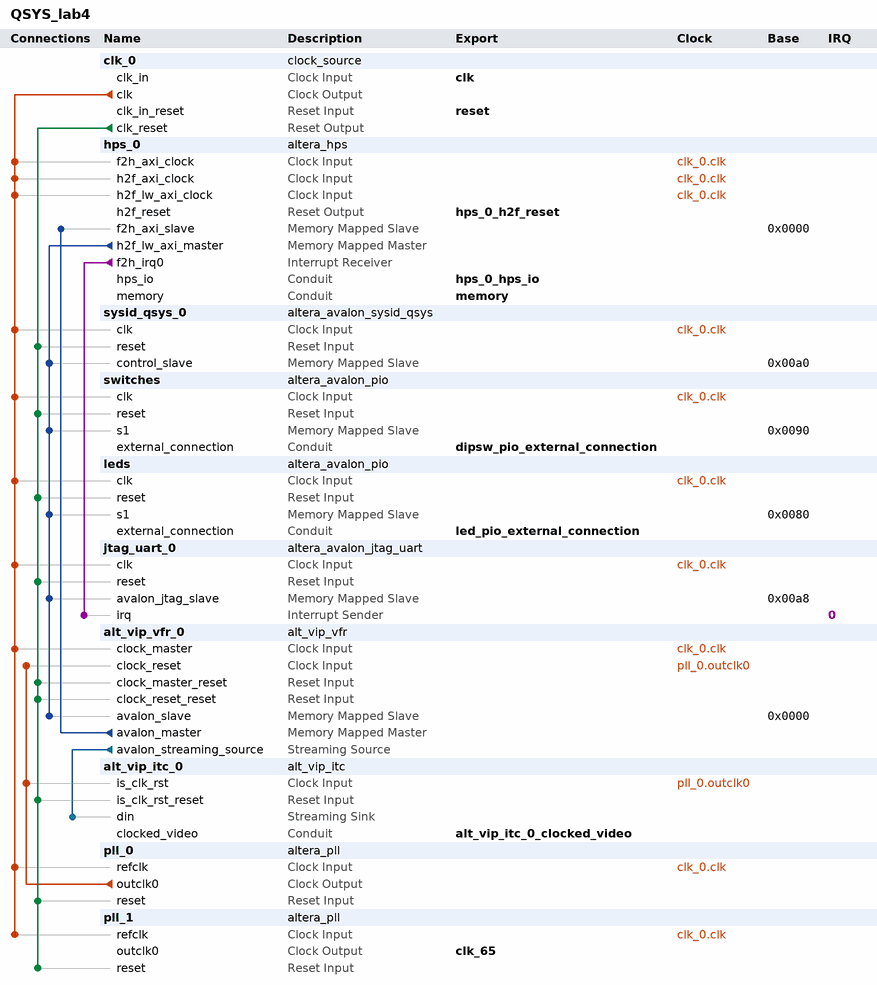
[diagram p0: system contents]
# Platform Designer (Qsys) system QSYS_lab4, Cyclone V 5CSEMA5F31C6
# Parameters at their usual value, and those the tool derives, are not listed.
package require -exact qsys 15.0
create_system QSYS_lab4
set_project_property DEVICE_FAMILY {Cyclone V}
set_project_property DEVICE 5CSEMA5F31C6

add_instance clk_0 clock_source 15.0
set_instance_parameter_value clk_0 clockFrequency 50000000

add_instance hps_0 altera_hps 15.0
set_instance_parameter_value hps_0 BOOTFROMFPGA_Enable true
set_instance_parameter_value hps_0 EMAC1_Mode N/A
set_instance_parameter_value hps_0 EMAC1_PinMuxing Unused
set_instance_parameter_value hps_0 F2SCLK_COLDRST_Enable false
set_instance_parameter_value hps_0 F2SCLK_DBGRST_Enable false
set_instance_parameter_value hps_0 F2SCLK_WARMRST_Enable false
set_instance_parameter_value hps_0 F2SINTERRUPT_Enable true
set_instance_parameter_value hps_0 F2S_Width 3
set_instance_parameter_value hps_0 FPGA_PERIPHERAL_OUTPUT_CLOCK_FREQ_EMAC0_GTX_CLK 100
set_instance_parameter_value hps_0 FPGA_PERIPHERAL_OUTPUT_CLOCK_FREQ_EMAC0_MD_CLK 2.5
set_instance_parameter_value hps_0 FPGA_PERIPHERAL_OUTPUT_CLOCK_FREQ_EMAC1_GTX_CLK 100
set_instance_parameter_value hps_0 FPGA_PERIPHERAL_OUTPUT_CLOCK_FREQ_EMAC1_MD_CLK 2.5
set_instance_parameter_value hps_0 HPS_PROTOCOL DDR3
set_instance_parameter_value hps_0 I2C0_Mode N/A
set_instance_parameter_value hps_0 I2C0_PinMuxing Unused
set_instance_parameter_value hps_0 I2C1_Mode N/A
set_instance_parameter_value hps_0 I2C1_PinMuxing Unused
set_instance_parameter_value hps_0 LWH2F_Enable true
set_instance_parameter_value hps_0 MEM_BANKADDR_WIDTH 3
set_instance_parameter_value hps_0 MEM_CLK_FREQ 400.0
set_instance_parameter_value hps_0 MEM_COL_ADDR_WIDTH 10
set_instance_parameter_value hps_0 MEM_DQ_WIDTH 32
set_instance_parameter_value hps_0 MEM_DRV_STR RZQ/7
set_instance_parameter_value hps_0 MEM_ROW_ADDR_WIDTH 15
set_instance_parameter_value hps_0 MEM_RTT_NOM RZQ/4
set_instance_parameter_value hps_0 MEM_RTT_WR RZQ/4
set_instance_parameter_value hps_0 MEM_TCL 11
set_instance_parameter_value hps_0 MEM_TFAW_NS 30.0
set_instance_parameter_value hps_0 MEM_TRAS_NS 35.0
set_instance_parameter_value hps_0 MEM_TRCD_NS 13.75
set_instance_parameter_value hps_0 MEM_TRFC_NS 260.0
set_instance_parameter_value hps_0 MEM_TRP_NS 13.75
set_instance_parameter_value hps_0 MEM_VENDOR JEDEC
set_instance_parameter_value hps_0 MEM_WTCL 8
set_instance_parameter_value hps_0 QSPI_Mode N/A
set_instance_parameter_value hps_0 QSPI_PinMuxing Unused
set_instance_parameter_value hps_0 REF_CLK_FREQ 25.0
set_instance_parameter_value hps_0 S2F_Width 2
set_instance_parameter_value hps_0 SDIO_Mode {4-bit Data}
set_instance_parameter_value hps_0 SDIO_PinMuxing {HPS I/O Set 0}
set_instance_parameter_value hps_0 SPIM1_Mode N/A
set_instance_parameter_value hps_0 SPIM1_PinMuxing Unused
set_instance_parameter_value hps_0 STM_Enable false
set_instance_parameter_value hps_0 TIMING_BOARD_AC_SKEW 0.03
set_instance_parameter_value hps_0 TIMING_BOARD_AC_TO_CK_SKEW 0.0
set_instance_parameter_value hps_0 TIMING_BOARD_DQ_TO_DQS_SKEW 0.0
set_instance_parameter_value hps_0 TIMING_BOARD_MAX_CK_DELAY 0.03
set_instance_parameter_value hps_0 TIMING_BOARD_MAX_DQS_DELAY 0.02
set_instance_parameter_value hps_0 TIMING_BOARD_SKEW_BETWEEN_DQS 0.08
set_instance_parameter_value hps_0 TIMING_BOARD_SKEW_CKDQS_DIMM_MAX 0.16
set_instance_parameter_value hps_0 TIMING_BOARD_SKEW_CKDQS_DIMM_MIN 0.09
set_instance_parameter_value hps_0 TIMING_BOARD_SKEW_WITHIN_DQS 0.01
set_instance_parameter_value hps_0 TIMING_TDH 65
set_instance_parameter_value hps_0 TIMING_TDQSCK 255
set_instance_parameter_value hps_0 TIMING_TDQSQ 125
set_instance_parameter_value hps_0 TIMING_TDS 30
set_instance_parameter_value hps_0 TIMING_TIH 140
set_instance_parameter_value hps_0 TIMING_TIS 180
set_instance_parameter_value hps_0 TIMING_TQSH 0.4
set_instance_parameter_value hps_0 UART0_Mode {No Flow Control}
set_instance_parameter_value hps_0 UART0_PinMuxing {HPS I/O Set 0}
set_instance_parameter_value hps_0 USB1_Mode SDR
set_instance_parameter_value hps_0 USB1_PinMuxing {HPS I/O Set 0}
set_instance_parameter_value hps_0 desired_cfg_clk_mhz 100.0
set_instance_parameter_value hps_0 desired_qspi_clk_mhz 400.0

add_instance sysid_qsys_0 altera_avalon_sysid_qsys 15.0
set_instance_parameter_value sysid_qsys_0 id 0

add_instance switches altera_avalon_pio 15.0
set_instance_parameter_value switches direction Input
set_instance_parameter_value switches simDoTestBenchWiring true
set_instance_parameter_value switches width 10

add_instance leds altera_avalon_pio 15.0
set_instance_parameter_value leds direction Output
set_instance_parameter_value leds width 10

add_instance jtag_uart_0 altera_avalon_jtag_uart 15.0
set_instance_parameter_value jtag_uart_0 simInteractiveOptions NO_INTERACTIVE_WINDOWS

add_instance alt_vip_vfr_0 alt_vip_vfr 14.0
set_instance_parameter_value alt_vip_vfr_0 MAX_IMAGE_WIDTH 1024

add_instance alt_vip_itc_0 alt_vip_itc 14.0
set_instance_parameter_value alt_vip_itc_0 FIFO_DEPTH 1920
set_instance_parameter_value alt_vip_itc_0 H_ACTIVE_PIXELS 1024
set_instance_parameter_value alt_vip_itc_0 H_BACK_PORCH 160
set_instance_parameter_value alt_vip_itc_0 H_FRONT_PORCH 24
set_instance_parameter_value alt_vip_itc_0 H_SYNC_LENGTH 136
set_instance_parameter_value alt_vip_itc_0 NUMBER_OF_COLOUR_PLANES 4
set_instance_parameter_value alt_vip_itc_0 THRESHOLD 1919
set_instance_parameter_value alt_vip_itc_0 V_ACTIVE_LINES 768
set_instance_parameter_value alt_vip_itc_0 V_BACK_PORCH 29
set_instance_parameter_value alt_vip_itc_0 V_FRONT_PORCH 3
set_instance_parameter_value alt_vip_itc_0 V_SYNC_LENGTH 6

add_instance pll_0 altera_pll 15.0
set_instance_parameter_value pll_0 gui_device_speed_grade 1
set_instance_parameter_value pll_0 gui_number_of_clocks 1
set_instance_parameter_value pll_0 gui_operation_mode normal
set_instance_parameter_value pll_0 gui_output_clock_frequency0 130.0
set_instance_parameter_value pll_0 gui_pll_mode {Fractional-N PLL}
set_instance_parameter_value pll_0 gui_reference_clock_frequency 50.0
set_instance_parameter_value pll_0 gui_use_locked true

add_instance pll_1 altera_pll 15.0
set_instance_parameter_value pll_1 gui_device_speed_grade 1
set_instance_parameter_value pll_1 gui_number_of_clocks 1
set_instance_parameter_value pll_1 gui_operation_mode direct
set_instance_parameter_value pll_1 gui_output_clock_frequency0 65.0
set_instance_parameter_value pll_1 gui_pll_mode {Integer-N PLL}
set_instance_parameter_value pll_1 gui_reference_clock_frequency 50.0
set_instance_parameter_value pll_1 gui_use_locked true

# connections
add_connection clk_0.clk alt_vip_vfr_0.clock_master clock
add_connection clk_0.clk hps_0.f2h_axi_clock clock
add_connection clk_0.clk hps_0.h2f_axi_clock clock
add_connection clk_0.clk hps_0.h2f_lw_axi_clock clock
add_connection clk_0.clk jtag_uart_0.clk clock
add_connection clk_0.clk leds.clk clock
add_connection clk_0.clk pll_0.refclk clock
add_connection clk_0.clk pll_1.refclk clock
add_connection clk_0.clk switches.clk clock
add_connection clk_0.clk sysid_qsys_0.clk clock
add_connection pll_0.outclk0 alt_vip_itc_0.is_clk_rst clock
add_connection pll_0.outclk0 alt_vip_vfr_0.clock_reset clock
add_connection clk_0.clk_reset alt_vip_itc_0.is_clk_rst_reset reset
add_connection clk_0.clk_reset alt_vip_vfr_0.clock_master_reset reset
add_connection clk_0.clk_reset alt_vip_vfr_0.clock_reset_reset reset
add_connection clk_0.clk_reset jtag_uart_0.reset reset
add_connection clk_0.clk_reset leds.reset reset
add_connection clk_0.clk_reset pll_0.reset reset
add_connection clk_0.clk_reset pll_1.reset reset
add_connection clk_0.clk_reset switches.reset reset
add_connection clk_0.clk_reset sysid_qsys_0.reset reset
add_connection alt_vip_vfr_0.avalon_master hps_0.f2h_axi_slave avalon
set_connection_parameter_value alt_vip_vfr_0.avalon_master/hps_0.f2h_axi_slave baseAddress 0x0000
add_connection hps_0.h2f_lw_axi_master alt_vip_vfr_0.avalon_slave avalon
set_connection_parameter_value hps_0.h2f_lw_axi_master/alt_vip_vfr_0.avalon_slave baseAddress 0x0000
add_connection hps_0.h2f_lw_axi_master jtag_uart_0.avalon_jtag_slave avalon
set_connection_parameter_value hps_0.h2f_lw_axi_master/jtag_uart_0.avalon_jtag_slave baseAddress 0x00a8
add_connection hps_0.h2f_lw_axi_master leds.s1 avalon
set_connection_parameter_value hps_0.h2f_lw_axi_master/leds.s1 baseAddress 0x0080
add_connection hps_0.h2f_lw_axi_master switches.s1 avalon
set_connection_parameter_value hps_0.h2f_lw_axi_master/switches.s1 baseAddress 0x0090
add_connection hps_0.h2f_lw_axi_master sysid_qsys_0.control_slave avalon
set_connection_parameter_value hps_0.h2f_lw_axi_master/sysid_qsys_0.control_slave baseAddress 0x00a0
add_connection alt_vip_vfr_0.avalon_streaming_source alt_vip_itc_0.din avalon_streaming
add_connection hps_0.f2h_irq0 jtag_uart_0.irq interrupt
set_connection_parameter_value hps_0.f2h_irq0/jtag_uart_0.irq irqNumber 0

# exported interfaces
add_interface alt_vip_itc_0_clocked_video conduit end
set_interface_property alt_vip_itc_0_clocked_video EXPORT_OF alt_vip_itc_0.clocked_video
add_interface clk clock sink
set_interface_property clk EXPORT_OF clk_0.clk_in
add_interface clk_65 clock source
set_interface_property clk_65 EXPORT_OF pll_1.outclk0
add_interface dipsw_pio_external_connection conduit end
set_interface_property dipsw_pio_external_connection EXPORT_OF switches.external_connection
add_interface hps_0_h2f_reset reset source
set_interface_property hps_0_h2f_reset EXPORT_OF hps_0.h2f_reset
add_interface hps_0_hps_io conduit end
set_interface_property hps_0_hps_io EXPORT_OF hps_0.hps_io
add_interface led_pio_external_connection conduit end
set_interface_property led_pio_external_connection EXPORT_OF leds.external_connection
add_interface memory conduit end
set_interface_property memory EXPORT_OF hps_0.memory
add_interface reset reset sink
set_interface_property reset EXPORT_OF clk_0.clk_in_reset

set_interconnect_requirement {$system} qsys_mm.clockCrossingAdapter HANDSHAKE
set_interconnect_requirement {$system} qsys_mm.enableEccProtection FALSE
set_interconnect_requirement {$system} qsys_mm.insertDefaultSlave FALSE
set_interconnect_requirement {$system} qsys_mm.maxAdditionalLatency 1

save_system QSYS_lab4.qsys
